# Altium project OBC_v8.PrjPcb
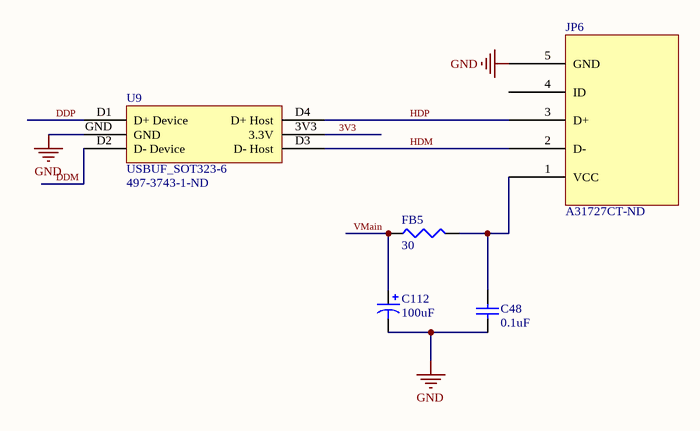
[diagram p0: USB.SchDoc]
4 sheets, 25 parts. Net scope: global (net labels, ports and power ports of the same name join across sheets).
Board file: OBC_v8.PcbDoc
Sheets:
  USB.SchDoc
  SDRAM.SchDoc
  NAND.SchDoc
  MRAM.SchDoc

## Sheet USB.SchDoc
size A4

### Parts
C48  value 0.1uF  [CAPC2008X06N]  (hidden comment: Kemet_0805_a_0.1uF)
C112  value 100uF  [6032]  (hidden comment: TantCap_6032_100uF)
FB5  Value @ 100MHz: 30  [0805]  (hidden comment: Murata_a_0805_30_Ohm_100Mhz)
JP6  Supplier Part Number 1: A31727CT-ND  [PCBComponent_1]  (hidden comment: Mini USB B)
U9  USBUF_SOT323-6  Supplier Part Number 1: 497-3743-1-ND  [SOT65P210X110-6N]

### Nets
GND: C48.1 C112.2 JP6.5(GND) U9.GND
3V3: U9.3V3(3.3V)
DDM: U9.D2(D-_Device)
DDP: U9.D1(D+_Device)
HDM: JP6.2(D-) U9.D3(D-_Host)
HDP: JP6.3(D+) U9.D4(D+_Host)
VMain: C112.1 FB5.1
NetC48_2: C48.2 FB5.2 JP6.1(VCC)

Not connected (* = marked no-connect by the designer): JP6 4(ID)

### Library data of the parts
C48 = Kemet_0805_a_0.1uF: CAP CER 0.1UF 50V 10% X7R 0805; Supplier 1: Digi-Key; Supplier Part Number 1: 399-1170-1-ND
C112 = TantCap_6032_100uF: CAP TANT 100UF 10V 10% LOESR SMD; Code_JEITA: 6032; ComponentLink1Description: Manufacturer Link; ComponentLink1URL: http://www.kemet.com; ComponentLink2Description: Datasheet; ComponentLink2URL: http://www.kemet.com/kemet/web/homepage/kechome.nsf/vapubfiles/B45197A_SpeedPower.pdf/$file/B45197A_SpeedPower.pdf; Supplier 1: Digi-Key; Supplier Part Number 1: 495-1528-1-ND
FB5 = Murata_a_0805_30_Ohm_100Mhz: FERRITE CHIP 30 OHM 3000MA 0805; Supplier 1: Digi-Key; Supplier Part Number 1: 490-1052-1-ND
JP6 = Mini USB B: Mini B USB Receptacle Type B; Supplier 1: Digi-Key
U9 = USBUF_SOT323-6: EMI FIlter and Line Termination for USB Upstream Ports; Manufacturer: ST Microelectronics; Supplier 1: Digi-Key

## Sheet SDRAM.SchDoc
size A4
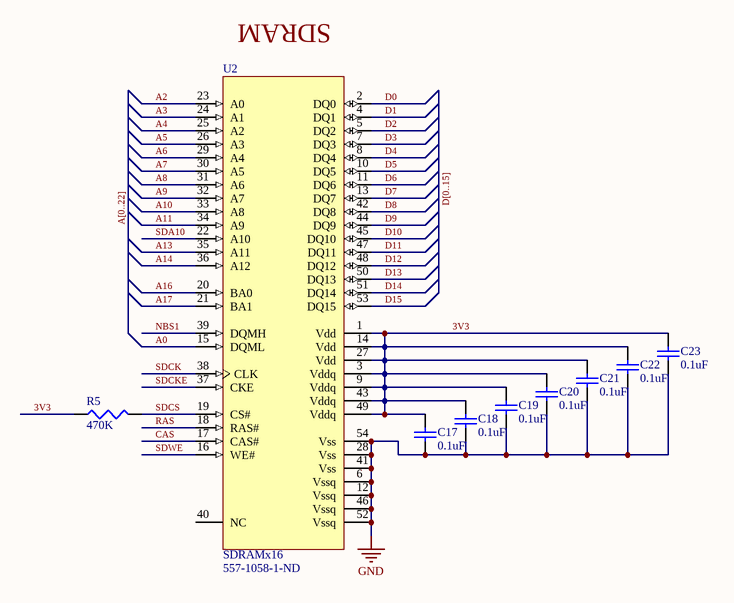
[diagram p1: SDRAM.SchDoc]

### Parts
C17  value 0.1uF  [CAPC2008X06N]  (hidden comment: Kemet_0805_a_0.1uF)
C18  value 0.1uF  [CAPC2008X06N]  (hidden comment: Kemet_0805_a_0.1uF)
C19  value 0.1uF  [CAPC2008X06N]  (hidden comment: Kemet_0805_a_0.1uF)
C20  value 0.1uF  [CAPC2008X06N]  (hidden comment: Kemet_0805_a_0.1uF)
C21  value 0.1uF  [CAPC2008X06N]  (hidden comment: Kemet_0805_a_0.1uF)
C22  value 0.1uF  [CAPC2008X06N]  (hidden comment: Kemet_0805_a_0.1uF)
C23  value 0.1uF  [CAPC2008X06N]  (hidden comment: Kemet_0805_a_0.1uF)
R5  value 470K  [RES0805]  (hidden comment: Susumu_0805_b3_470K)
U2  SDRAMx16  Supplier Part Number 1: 557-1058-1-ND  [TSOP54]

### Nets
GND: C17.1 C18.1 C19.1 C20.1 C21.1 C22.1 C23.1 U2.6(Vssq) U2.12(Vssq) U2.28(Vss) U2.41(Vss) U2.46(Vssq) U2.52(Vssq) U2.54(Vss)
3V3: C17.2 C18.2 C19.2 C20.2 C21.2 C22.2 C23.2 R5.1 U2.1(Vdd) U2.3(Vddq) U2.9(Vddq) U2.14(Vdd) U2.27(Vdd) U2.43(Vddq) U2.49(Vddq)
A0: U2.15(DQML)
A2: U2.23(A0)
A3: U2.24(A1)
A4: U2.25(A2)
A5: U2.26(A3)
A6: U2.29(A4)
A7: U2.30(A5)
A8: U2.31(A6)
A9: U2.32(A7)
A10: U2.33(A8)
A11: U2.34(A9)
A13: U2.35(A11)
A14: U2.36(A12)
A16: U2.20(BA0)
A17: U2.21(BA1)
CAS: U2.17(CAS#)
D0: U2.2(DQ0)
D1: U2.4(DQ1)
D2: U2.5(DQ2)
D3: U2.7(DQ3)
D4: U2.8(DQ4)
D5: U2.10(DQ5)
D6: U2.11(DQ6)
D7: U2.13(DQ7)
D8: U2.42(DQ8)
D9: U2.44(DQ9)
D10: U2.45(DQ10)
D11: U2.47(DQ11)
D12: U2.48(DQ12)
D13: U2.50(DQ13)
D14: U2.51(DQ14)
D15: U2.53(DQ15)
NBS1: U2.39(DQMH)
RAS: U2.18(RAS#)
SDA10: U2.22(A10)
SDCK: U2.38(CLK)
SDCKE: U2.37(CKE)
SDCS: R5.2 U2.19(CS#)
SDWE: U2.16(WE#)

Not connected (* = marked no-connect by the designer): U2 40(NC)

### Buses and harness runs
bus A[0..22]
bus D[0..15]

### Notes on the sheet
- SDRAM

### Library data of the parts
C17-C23 = Kemet_0805_a_0.1uF: CAP CER 0.1UF 50V 10% X7R 0805; Supplier 1: Digi-Key; Supplier Part Number 1: 399-1170-1-ND
R5 = Susumu_0805_b3_470K: RES 470K OHM 1/10W .5% 0805 SMD; Supplier 1: Digi-Key; Supplier Part Number 1: RR12P470KDCT-ND
U2 = SDRAMx16: SDRAM 54 TSOP II x16 architecture; Manufacturer: Micron Technology INC.; Supplier 1: Digi-Key

## Sheet NAND.SchDoc
size A4
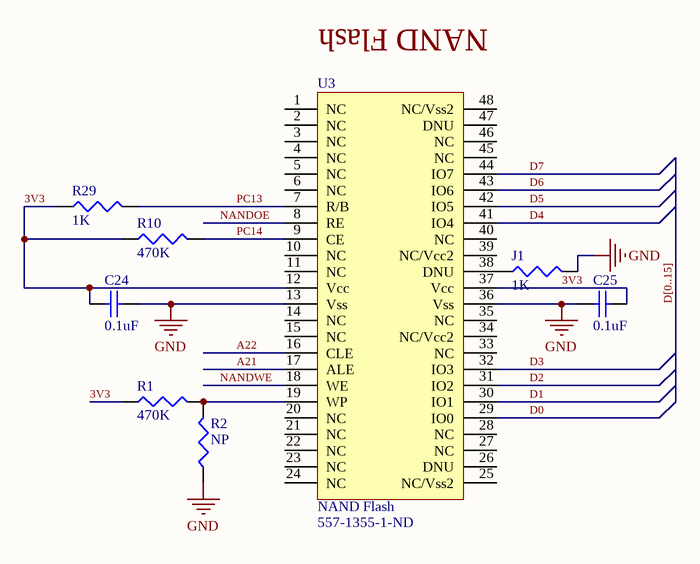
[diagram p2: NAND.SchDoc]

### Parts
C24  value 0.1uF  [CAPC2008X06N]  (hidden comment: Kemet_0805_a_0.1uF)
C25  value 0.1uF  [CAPC2008X06N]  (hidden comment: Kemet_0805_a_0.1uF)
J1  value 1K  [RES0805]  (hidden comment: Susumu_0805_b1_1K)
R1  value 470K  [RES0805]  (hidden comment: Susumu_0805_b3_470K)
R2  value NP  [RES0805]  (hidden comment: 0805_NP)
R10  value 470K  [RES0805]  (hidden comment: Susumu_0805_b3_470K)
R29  value 1K  [RES0805]  (hidden comment: Susumu_0805_b1_1K)
U3  NAND Flash  Supplier Part Number 1: 557-1355-1-ND  [NAND Flash]

### Nets
GND: C24.2 C25.1 J1.2 R2.1 U3.13(Vss) U3.36(Vss)
3V3: C24.1 C25.2 R1.1 R10.1 R29.1 U3.12(Vcc) U3.37(Vcc)
A21: U3.17(ALE)
A22: U3.16(CLE)
D0: U3.29(IO0)
D1: U3.30(IO1)
D2: U3.31(IO2)
D3: U3.32(IO3)
D4: U3.41(IO4)
D5: U3.42(IO5)
D6: U3.43(IO6)
D7: U3.44(IO7)
NANDOE: U3.8(RE)
NANDWE: U3.18(WE)
PC13: R29.2 U3.7(R/B)
PC14: R10.2 U3.9(CE)
NetJ1_1: J1.1 U3.38(DNU)
NetR1_2: R1.2 R2.2 U3.19(WP)

Not connected (* = marked no-connect by the designer): U3 1(NC) 2(NC) 3(NC) 4(NC) 5(NC) 6(NC) 10(NC) 11(NC) 14(NC) 15(NC) 20(NC) 21(NC) 22(NC) 23(NC) 24(NC) 25(NC/Vss2) 26(DNU) 27(NC) 28(NC) 33(NC) 34(NC/Vcc2) 35(NC) 39(NC/Vcc2) 40(NC) 45(NC) 46(NC) 47(DNU) 48(NC/Vss2)

### Buses and harness runs
bus D[0..15]

### Notes on the sheet
- (near U3) NAND Flash

### Library data of the parts
C24 C25 = Kemet_0805_a_0.1uF: CAP CER 0.1UF 50V 10% X7R 0805; Supplier 1: Digi-Key; Supplier Part Number 1: 399-1170-1-ND
J1 R29 = Susumu_0805_b1_1K: RES 1.0K OHM 1/10W .5% 0805 SMD; Supplier 1: Digi-Key; Supplier Part Number 1: RR12P1.0KDCT-ND
R1 R10 = Susumu_0805_b3_470K: RES 470K OHM 1/10W .5% 0805 SMD; Supplier 1: Digi-Key; Supplier Part Number 1: RR12P470KDCT-ND
R2 = 0805_NP: No populate
U3 = NAND Flash: NAND Flash TSOP48; Manufacturer: Micron Technology INC.; Supplier 1: Digi-Key

## Sheet MRAM.SchDoc
size A4
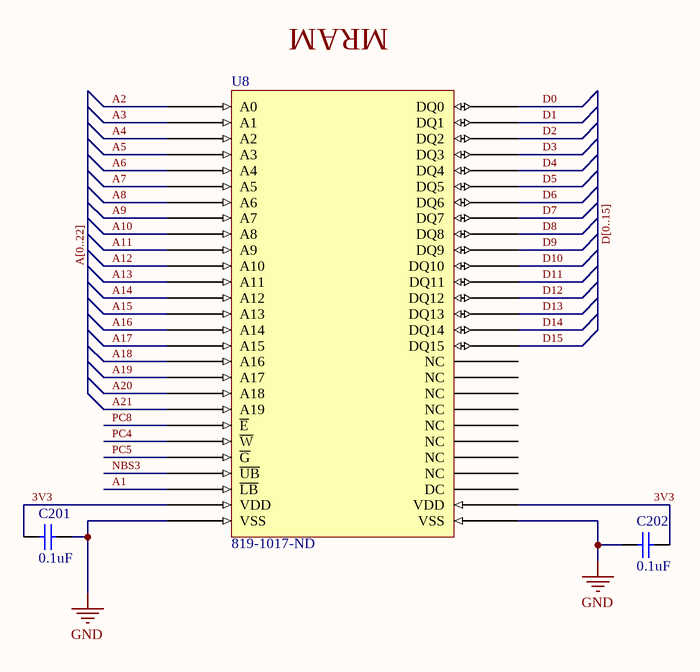
[diagram p3: MRAM.SchDoc]

### Parts
C201  value 0.1uF  [CAPC2008X06N]  (hidden comment: Kemet_0805_a_0.1uF)
C202  value 0.1uF  [CAPC2008X06N]  (hidden comment: Kemet_0805_a_0.1uF)
U8  Supplier Part Number 1: 819-1017-ND  [TSOP80P1180X120_HS-54N]  (hidden comment: MRAM (Magnetoresistive RAM))

### Nets
GND: C201.2 C202.1 U8.14(VSS) U8.42(VSS)
3V3: C201.1 C202.2 U8.13(VDD) U8.41(VDD)
A1: U8.47(~{LB})
A2: U8.3(A0)
A3: U8.4(A1)
A4: U8.5(A2)
A5: U8.6(A3)
A6: U8.7(A4)
A7: U8.20(A5)
A8: U8.21(A6)
A9: U8.22(A7)
A10: U8.23(A8)
A11: U8.24(A9)
A12: U8.31(A10)
A13: U8.32(A11)
A14: U8.33(A12)
A15: U8.34(A13)
A16: U8.35(A14)
A17: U8.50(A15)
A18: U8.51(A16)
A19: U8.52(A17)
A20: U8.53(A18)
A21: U8.2(A19)
D0: U8.9(DQ0)
D1: U8.10(DQ1)
D2: U8.11(DQ2)
D3: U8.12(DQ3)
D4: U8.15(DQ4)
D5: U8.16(DQ5)
D6: U8.17(DQ6)
D7: U8.18(DQ7)
D8: U8.37(DQ8)
D9: U8.38(DQ9)
D10: U8.39(DQ10)
D11: U8.40(DQ11)
D12: U8.43(DQ12)
D13: U8.44(DQ13)
D14: U8.45(DQ14)
D15: U8.46(DQ15)
NBS3: U8.48(~{UB})
PC4: U8.19(~{W})
PC5: U8.49(~{G})
PC8: U8.8(~{E})

Not connected (* = marked no-connect by the designer): U8 1(NC) 25(NC) 26(NC) 27(NC) 28(NC) 29(NC) 30(NC) 36(DC) 54(NC)

### Buses and harness runs
bus A[0..22]
bus D[0..15]

### Notes on the sheet
- (near U8) MRAM

### Library data of the parts
C201 C202 = Kemet_0805_a_0.1uF: CAP CER 0.1UF 50V 10% X7R 0805; Supplier 1: Digi-Key; Supplier Part Number 1: 399-1170-1-ND
U8 = MR4A16BCYS35: IC MRAM 16MBIT 35NS 54TSOP; ComponentLink1Description: Manufacturer Link; ComponentLink1URL: http://www.everspin.com/; ComponentLink2Description: Datasheet; ComponentLink2URL: http://www.everspin.com/PDF/EST_MR4A16B_preliminary.pdf; PackageDescription: 54 TSOP; Supplier 1: Digi-Key

## Nets that join several sheets
GND: USB (C48.1 C112.2 JP6.5 U9.GND), SDRAM (14 pins), NAND (6 pins), MRAM (C201.2 C202.1 U8.14 U8.42)
3V3: USB (U9.3V3), SDRAM (15 pins), NAND (7 pins), MRAM (C201.1 C202.2 U8.13 U8.41)
A2: SDRAM (U2.23), MRAM (U8.3)
A3: SDRAM (U2.24), MRAM (U8.4)
A4: SDRAM (U2.25), MRAM (U8.5)
A5: SDRAM (U2.26), MRAM (U8.6)
A6: SDRAM (U2.29), MRAM (U8.7)
A7: SDRAM (U2.30), MRAM (U8.20)
A8: SDRAM (U2.31), MRAM (U8.21)
A9: SDRAM (U2.32), MRAM (U8.22)
A10: SDRAM (U2.33), MRAM (U8.23)
A11: SDRAM (U2.34), MRAM (U8.24)
A13: SDRAM (U2.35), MRAM (U8.32)
A14: SDRAM (U2.36), MRAM (U8.33)
A16: SDRAM (U2.20), MRAM (U8.35)
A17: SDRAM (U2.21), MRAM (U8.50)
A21: NAND (U3.17), MRAM (U8.2)
D0: SDRAM (U2.2), NAND (U3.29), MRAM (U8.9)
D1: SDRAM (U2.4), NAND (U3.30), MRAM (U8.10)
D2: SDRAM (U2.5), NAND (U3.31), MRAM (U8.11)
D3: SDRAM (U2.7), NAND (U3.32), MRAM (U8.12)
D4: SDRAM (U2.8), NAND (U3.41), MRAM (U8.15)
D5: SDRAM (U2.10), NAND (U3.42), MRAM (U8.16)
D6: SDRAM (U2.11), NAND (U3.43), MRAM (U8.17)
D7: SDRAM (U2.13), NAND (U3.44), MRAM (U8.18)
D8: SDRAM (U2.42), MRAM (U8.37)
D9: SDRAM (U2.44), MRAM (U8.38)
D10: SDRAM (U2.45), MRAM (U8.39)
D11: SDRAM (U2.47), MRAM (U8.40)
D12: SDRAM (U2.48), MRAM (U8.43)
D13: SDRAM (U2.50), MRAM (U8.44)
D14: SDRAM (U2.51), MRAM (U8.45)
D15: SDRAM (U2.53), MRAM (U8.46)